# Altium schematic sheet CONNECTORS.SchDoc
size A; SheetNumber: 6; SheetTotal: 8
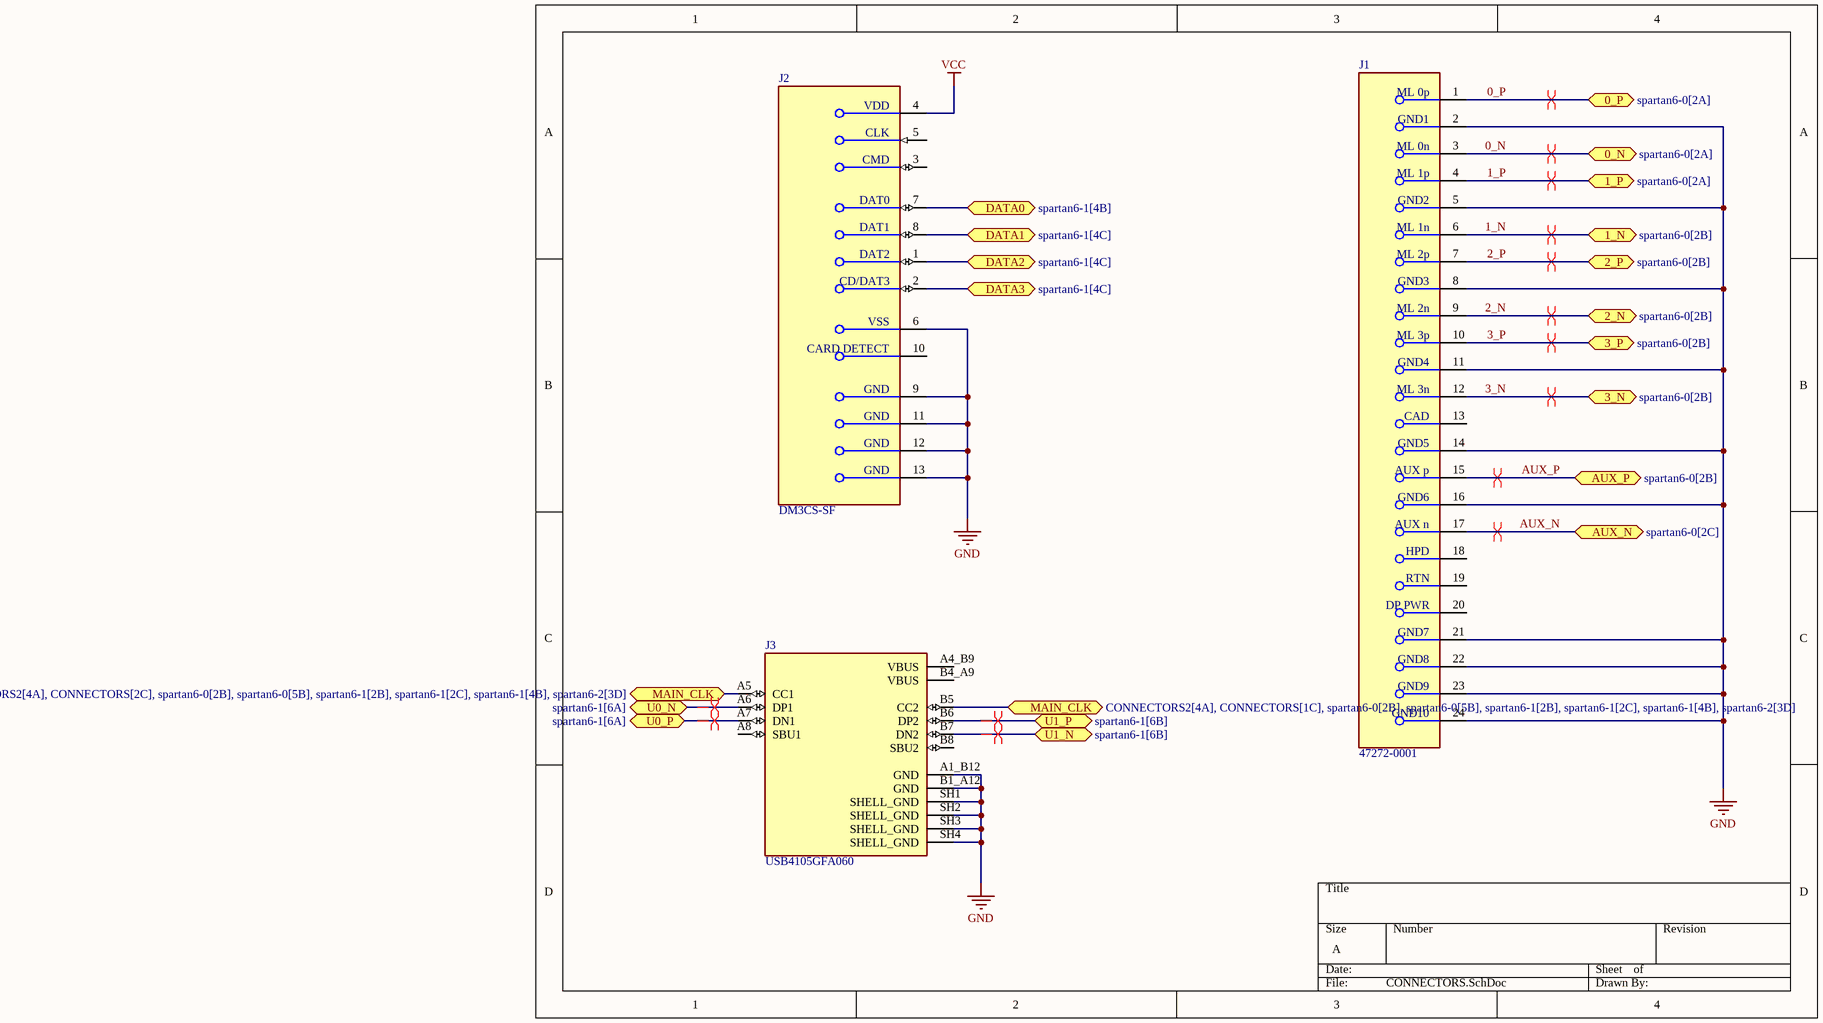
[diagram p0: CONNECTORS.SchDoc]

## Parts
J1  47272-0001  [FP-47272-0001-MFG]
J2  DM3CS-SF  [FP-DM3CS-SF-MFG]
J3  USB4105GFA060  [GCT_USB4105GFA060]

## Ports
0_N (bidir, see spartan6-0[2A]), 0_P (bidir, see spartan6-0[2A]), 1_N (bidir, see spartan6-0[2B]), 1_P (bidir, see spartan6-0[2A]), 2_N (bidir, see spartan6-0[2B]), 2_P (bidir, see spartan6-0[2B]), 3_N (bidir, see spartan6-0[2B]), 3_P (bidir, see spartan6-0[2B]), AUX_N (bidir, see spartan6-0[2C]), AUX_P (bidir, see spartan6-0[2B]), DATA0 (bidir, see spartan6-1[4B]), DATA1 (bidir, see spartan6-1[4C]), DATA2 (bidir, see spartan6-1[4C]), DATA3 (bidir, see spartan6-1[4C]), MAIN_CLK (bidir, see CONNECTORS2[4A], CONNECTORS[1C], spartan6-0[2B], spartan6-0[5B], spartan6-1[2B], spartan6-1[2C], spartan6-1[4B], spartan6-2[3D]), MAIN_CLK (bidir, see CONNECTORS2[4A], CONNECTORS[2C], spartan6-0[2B], spartan6-0[5B], spartan6-1[2B], spartan6-1[2C], spartan6-1[4B], spartan6-2[3D]), U0_N (bidir, see spartan6-1[6A]), U0_P (bidir, see spartan6-1[6A]), U1_N (bidir, see spartan6-1[6B]), U1_P (bidir, see spartan6-1[6B])

## Nets
GND: J1.2(GND1) J1.5(GND2) J1.8(GND3) J1.11(GND4) J1.14(GND5) J1.16(GND6) J1.21(GND7) J1.22(GND8) J1.23(GND9) J1.24(GND10) J2.6(VSS) J2.9(GND) J2.11(GND) J2.12(GND) J2.13(GND) J3.A1_B12(GND) J3.B1_A12(GND) J3.SH1(SHELL_GND) J3.SH2(SHELL_GND) J3.SH3(SHELL_GND) J3.SH4(SHELL_GND)
VCC: J2.4(VDD)
0_N: J1.3(ML_0n) ; port 0_N
0_P: J1.1(ML_0p) ; port 0_P
1_N: J1.6(ML_1n) ; port 1_N
1_P: J1.4(ML_1p) ; port 1_P
2_N: J1.9(ML_2n) ; port 2_N
2_P: J1.7(ML_2p) ; port 2_P
3_N: J1.12(ML_3n) ; port 3_N
3_P: J1.10(ML_3p) ; port 3_P
AUX_N: J1.17(AUX_n) ; port AUX_N
AUX_P: J1.15(AUX_p) ; port AUX_P
DATA0: J2.7(DAT0) ; port DATA0
DATA1: J2.8(DAT1) ; port DATA1
DATA2: J2.1(DAT2) ; port DATA2
DATA3: J2.2(CD/DAT3) ; port DATA3
MAIN_CLK: J3.A5(CC1) J3.B5(CC2) ; port MAIN_CLK
U0_N: J3.A6(DP1) ; port U0_N
U0_P: J3.A7(DN1) ; port U0_P
U1_N: J3.B7(DN2) ; port U1_N
U1_P: J3.B6(DP2) ; port U1_P

Not connected (* = marked no-connect by the designer): J1 13(CAD) 18(HPD) 19(RTN) 20(DP_PWR); J2 3(CMD) 5(CLK) 10(CARD_DETECT); J3 A4_B9(VBUS) A8(SBU1) B4_A9(VBUS) B8(SBU2)

## Layout directives
differential pair: 0_N, 0_P, 1_N, 1_P, 2_N, 2_P, 3_N, 3_P, AUX_N, AUX_P, U0_N, U0_P, U1_N, U1_P

## Library data of the parts
J1 = CMP-2000-05608-2: CONN RCPT DISPLAYPORT 20P SMD RA; Manufacturer: Molex; Voltage Rating: 40V; Is Female: yes; Shielding: true; Number Of Contacts: 20; Conn Orientation: Right Angle; Current Rating: 0.5A; Pitch: 0.5mm; Device Class L2: Audio / Video Connectors; Temperature: -20°C to +85°C; Contact Material: Gold,Nickel; Footprint Url: https://www.molex.com/pdm_docs/sd/472720001_sd.pdf; Device Class L1: Connectors; ComponentLink2Description: Datasheet; Temperature Range Low: -20°C; Automotive: No; Package: 0; Height: 6.9mm; RoHS: TRUE; Octopart: https://octopart.com/47272-0001-molex-5441289; Lead Free: Yes; ComponentLink2URL: https://www.molex.com/webdocs/datasheets/pdf/en-us/0472720001_IO_CONNECTORS.pdf; Device Class L3: unset; Mouser Description: HDMI, Displayport & DVI Connectors .5MM RA SMT RCPT; Category: Conn; Manufacturer Part Number: 47272-0001; Digikey Description: CONN RCPT DISPLAYPORT 20P SMD RA; Temperature Range High: +85°C
J2 = CMP-11597-000003-1: CONN MICRO SD CARD HINGED TYPE; Pitch: 1.1mm; Connector Type: Connector; Current Rating: 500mA; Voltage Rating (AC): 125V; Gender: Female; Insulation Resistance: 1GR; Number of Positions: 8; Contact Resistance: 100mR; Packaging: Tape and Reel; Flammability Rating: UL94 V-0; Lead Free: Lead Free; Min Operating Temperature: -25°C; Orientation: Right Angle; Width: 13.8mm; Number of Rows: 1; Housing Material: Polymer; Package Quantity: 1; Mount: Surface Mount; Max Current Rating: 500mA; Radiation Hardening: No; Max Operating Temperature: 85°C; Contact Plating: Gold; Depth: 1.83mm; Contact Material: Gold; Length: 14.1mm; Number of Contacts: 8; Termination: Solder
J3 = USB4105GFA060: MF: {'manufacturer': u'GCT'}; Package: None; Price: None; Value: *; MP: USB4105GFA060; Availability: Unavailable